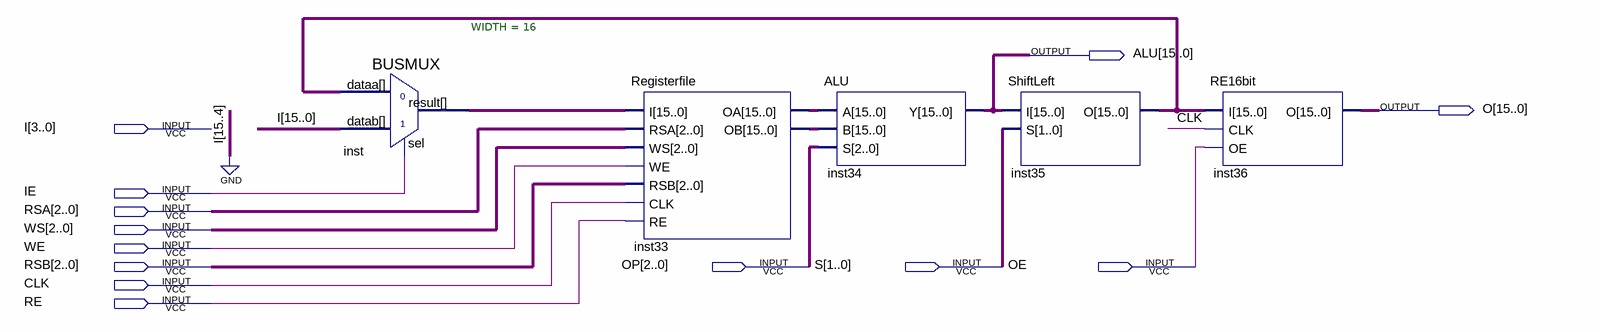
[diagram p0: schematic sheet]
// Quartus schematic Datapath.bdf as structural Verilog: 5 symbols, 13 pins
module Datapath (
  input  [3:0] I,
  input  IE,
  input  [2:0] RSA,
  input  [2:0] WS,
  input  WE,
  input  [2:0] RSB,
  input  [2:0] OP,
  input  [1:0] S,
  input  OE,
  input  CLK,
  input  RE,
  output [15:0] ALU,
  output [15:0] O
);

  wire [15:0] inst33_oa, inst33_ob, inst35_o, inst_result;

  BUSMUX #(.WIDTH(16)) inst (.datab({{12{1'b0}}, I}), .sel(IE), .dataa(inst35_o), .result(inst_result));
  Registerfile inst33 (
    .I(inst_result), .RSA(RSA), .WS(WS), .WE(WE), .RSB(RSB), .CLK(CLK), .RE(RE), .OA(inst33_oa),
    .OB(inst33_ob));
  ALU inst34 (.A(inst33_oa), .B(inst33_ob), .S(OP), .Y(ALU));
  ShiftLeft inst35 (.I(ALU), .S(S), .O(inst35_o));
  RE16bit inst36 (.I(inst35_o), .CLK(CLK), .OE(OE), .O(O));
endmodule
